# EAGLE schematic Flex_Battery_Interrupter_100 (EAGLE 9.6.2)
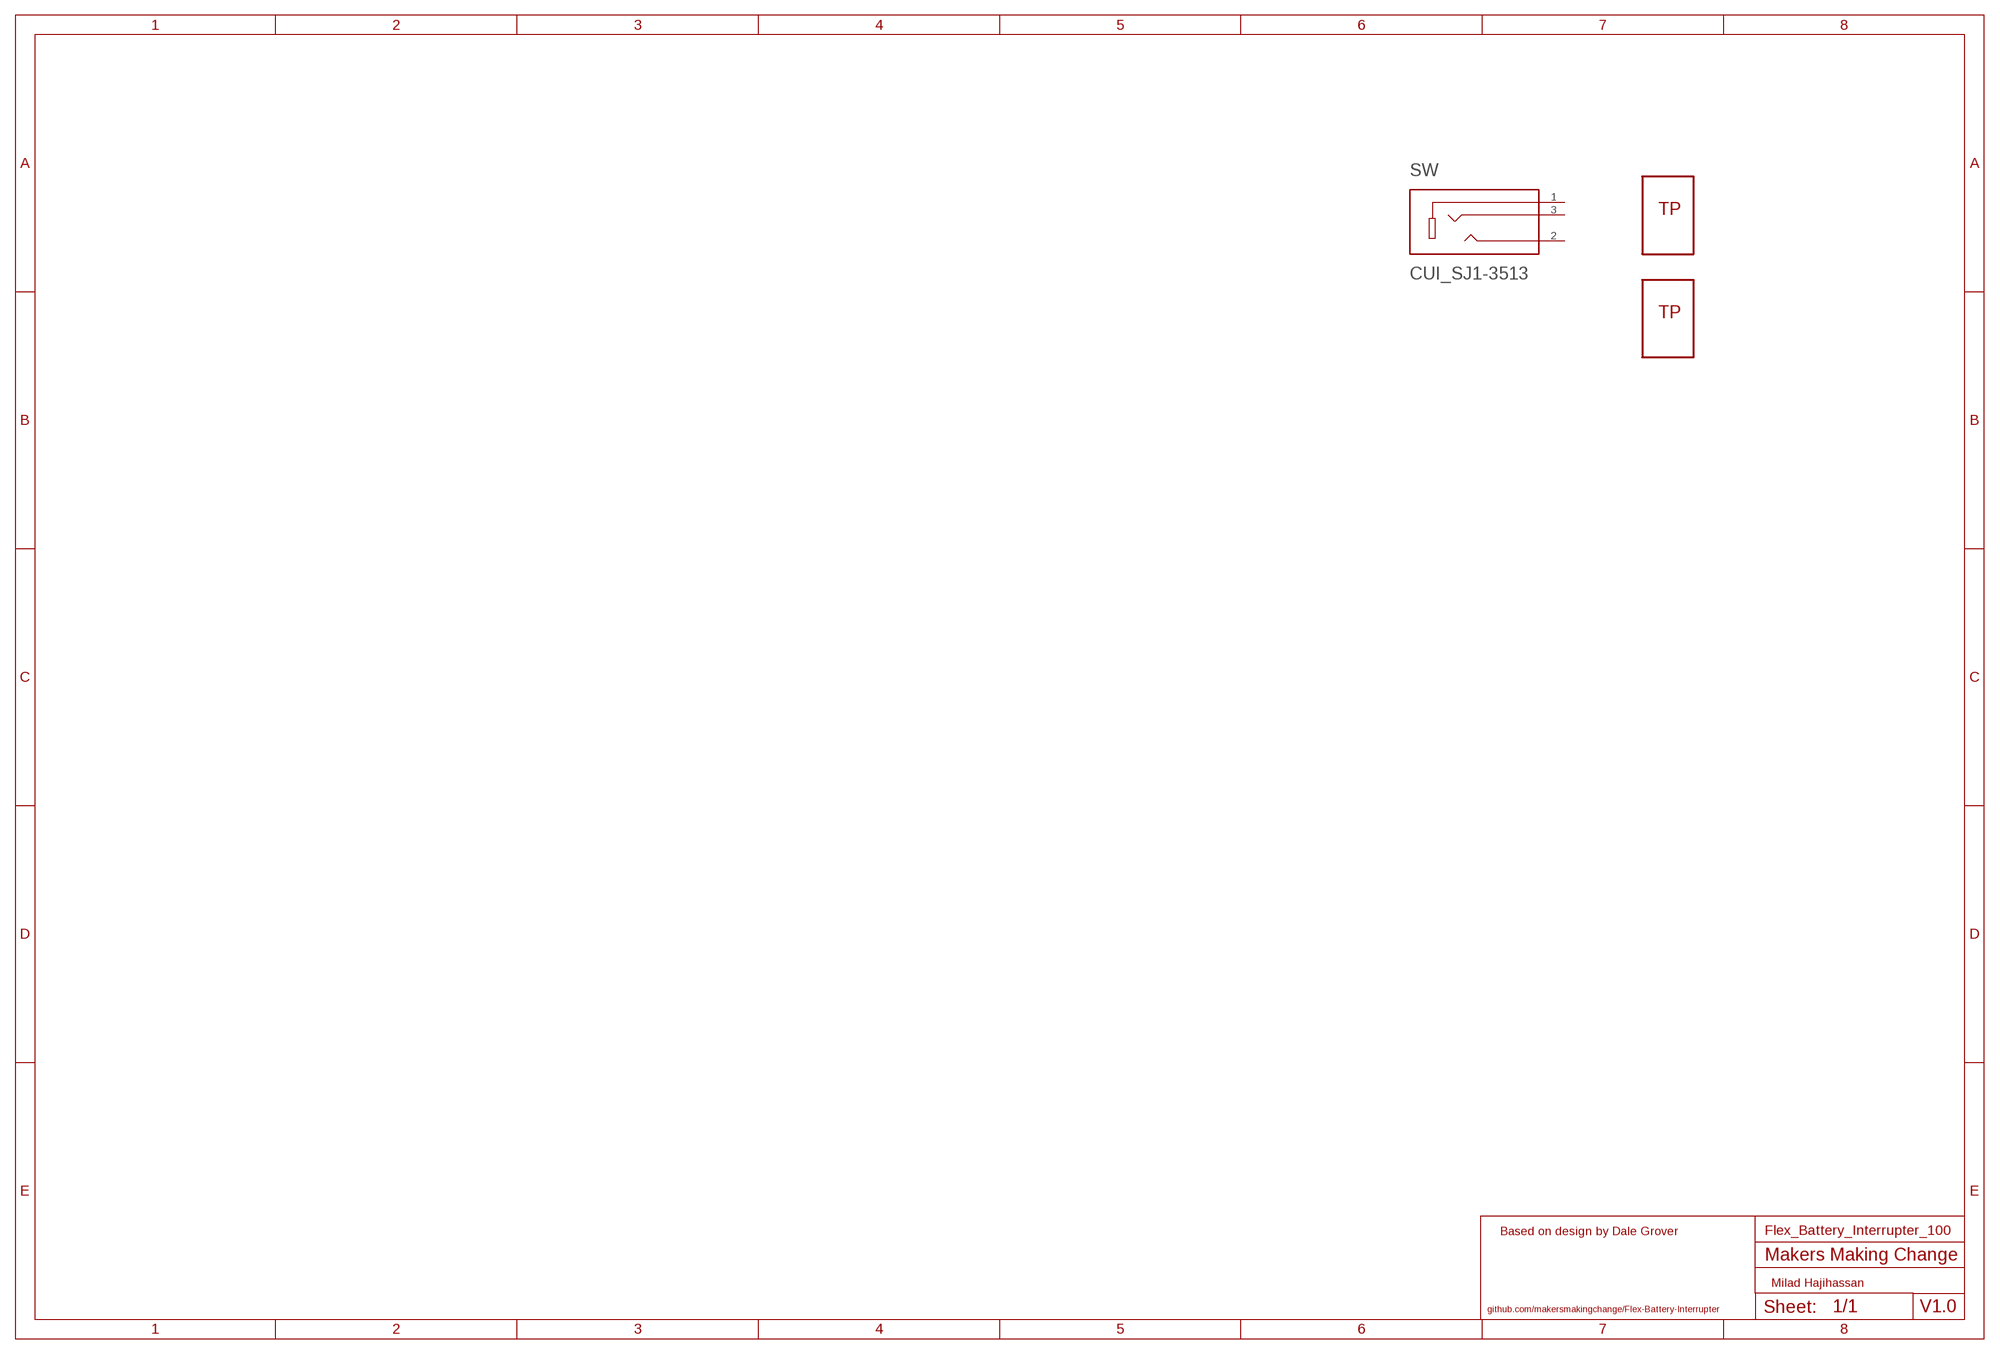
[diagram p0: schematic, sheet 1]

## Parts
SW  CUI_SJ1-3513  [CUI_SJ1-3513]
U$1  BATTERY-PADTOP  [BATTERY-PAD-TOP]
U$2  BATTERY-PADBOTTOM  [BATTERY-PAD-BOTTOM]
Unconnected: SW.1 SW.2 SW.3

## Notes on the sheet
- Based on design by Dale Grover
- Makers Making Change
- Milad Hajihassan
- github.com/makersmakingchange/Flex-Battery-Interrupter | V1.0

## Library data of the parts
SW = MMC Eagle:CUI_SJ1-3513
U$1 U$2 = MMC Eagle:BATTERY-PAD

## Net classes
2 GND2: clearance 0.205 mm to class 0, clearance 0.205 mm to class 1, clearance 0.205 mm
3 GND3: clearance 0.205 mm to class 0, clearance 0.205 mm to class 1, clearance 0.205 mm to class 2, clearance 0.205 mm